# Altium schematic sheet ZHSD-PL-CONNS.SchDoc
size 420 x 297 mm; DrawnBy: UGUR KELES; DocumentNumber: 17; SheetNumber: 17; SheetTotal: 17; Size: A4
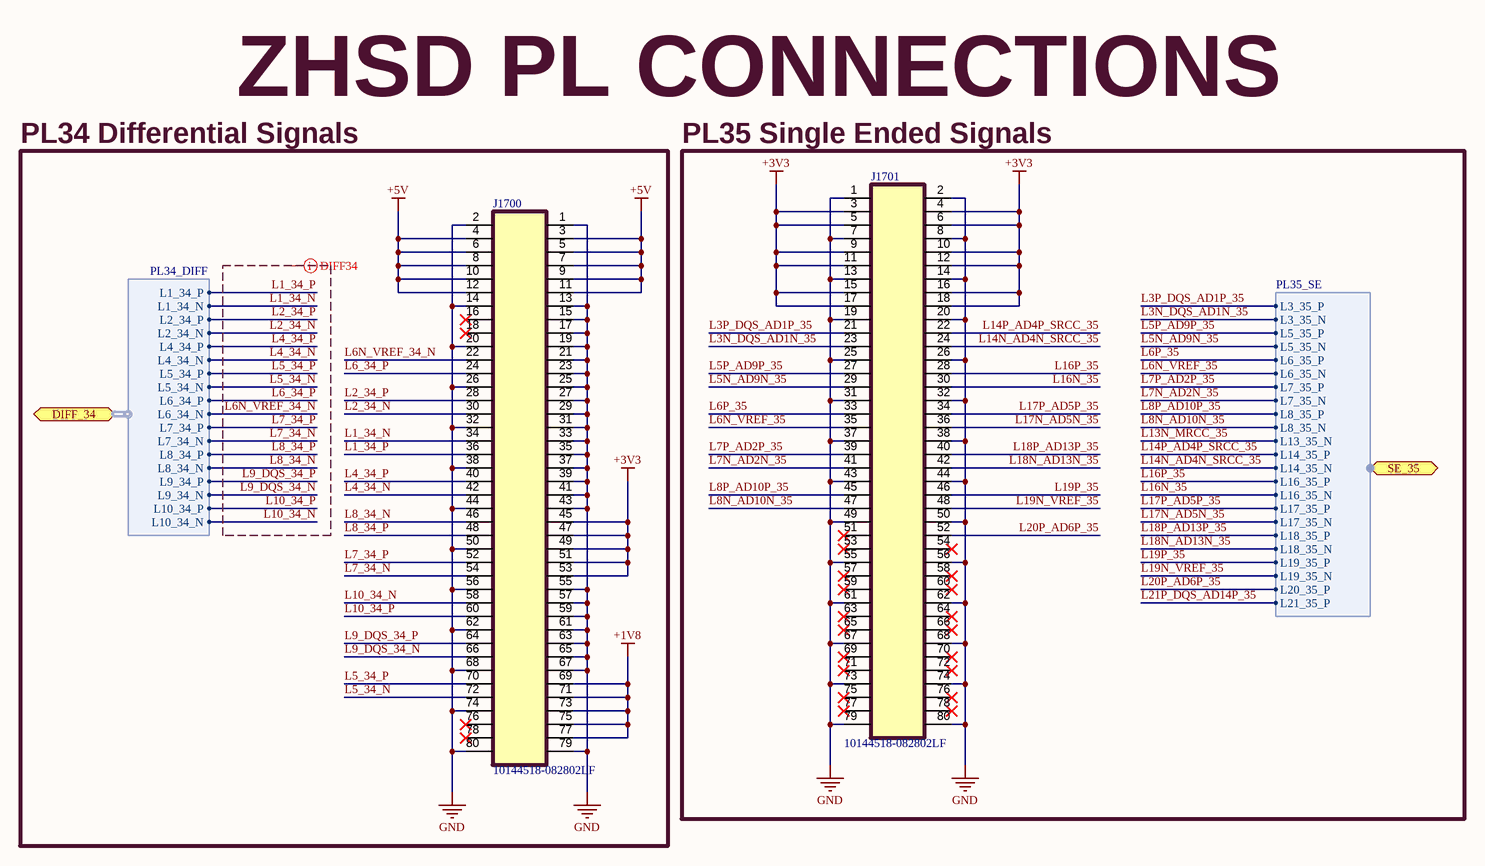
[diagram p0: ZHSD-PL-CONNS.SchDoc]

## Parts
J1700  10144518-082802LF  [10144518-082802LF]
J1701  10144518-082802LF  [10144518-082802LF]

## Blocks framed on the sheet
PL34 Differential Signals: J1700
PL35 Single Ended Signals: J1701

## Ports
DIFF_34 (bidir, harness PL34_DIFF, see ZHSD-Block[276.36,99.18], ZHSD-ZYNQ-PL[229.98,211.12]), SE_35 (bidir, harness PL35_SE, see ZHSD-Block[276.36,91.56], ZHSD-ZYNQ-PL[374.76,81.58])

## Harnesses
PL34_DIFF: L1_34_P, L1_34_N, L2_34_P, L2_34_N, L4_34_P, L4_34_N, L5_34_P, L5_34_N, L6_34_P, L6_34_N, L7_34_P, L7_34_N, L8_34_P, L8_34_N, L9_34_P, L9_34_N, L10_34_P, L10_34_N
PL35_SE: L3_35_P, L3_35_N, L5_35_P, L5_35_N, L6_35_P, L6_35_N, L7_35_P, L7_35_N, L8_35_P, L8_35_N, L13_35_N, L14_35_P, L14_35_N, L16_35_P, L16_35_N, L17_35_P, L17_35_N, L18_35_P, L18_35_N, L19_35_P, L19_35_N, L20_35_P, L21_35_P

## Nets
+1V8: J1700.69 J1700.71 J1700.73 J1700.75 J1700.77
+3V3: J1700.45 J1700.47 J1700.49 J1700.51 J1700.53 J1701.3 J1701.4 J1701.5 J1701.6 J1701.9 J1701.10 J1701.11 J1701.12 J1701.15 J1701.16 J1701.17 J1701.18
+5V: J1700.3 J1700.4 J1700.5 J1700.6 J1700.7 J1700.8 J1700.9 J1700.10 J1700.11 J1700.12
GND: J1700.1 J1700.2 J1700.13 J1700.14 J1700.15 J1700.17 J1700.19 J1700.20 J1700.21 J1700.23 J1700.25 J1700.26 J1700.27 J1700.29 J1700.31 J1700.32 J1700.33 J1700.35 J1700.37 J1700.38 J1700.39 J1700.41 J1700.43 J1700.44 J1700.50 J1700.55 J1700.56 J1700.57 J1700.59 J1700.61 J1700.62 J1700.63 J1700.65 J1700.67 J1700.68 J1700.74 J1700.79 J1700.80 J1701.1 J1701.2 J1701.7 J1701.8 J1701.13 J1701.14 J1701.19 J1701.20 J1701.25 J1701.26 J1701.31 J1701.32 J1701.37 J1701.38 J1701.43 J1701.44 J1701.49 J1701.50 J1701.55 J1701.56 J1701.61 J1701.62 J1701.67 J1701.68 J1701.73 J1701.74 J1701.79 J1701.80
L1_34_N: J1700.34 ; port DIFF_34.L1_34_N
L1_34_P: J1700.36 ; port DIFF_34.L1_34_P
L2_34_N: J1700.30 ; port DIFF_34.L2_34_N
L2_34_P: J1700.28 ; port DIFF_34.L2_34_P
L3N_DQS_AD1N_35: J1701.23 ; port SE_35.L3_35_N
L3P_DQS_AD1P_35: J1701.21 ; port SE_35.L3_35_P
L4_34_N: J1700.42 ; port DIFF_34.L4_34_N
L4_34_P: J1700.40 ; port DIFF_34.L4_34_P
L5_34_N: J1700.72 ; port DIFF_34.L5_34_N
L5_34_P: J1700.70 ; port DIFF_34.L5_34_P
L5N_AD9N_35: J1701.29 ; port SE_35.L5_35_N
L5P_AD9P_35: J1701.27 ; port SE_35.L5_35_P
L6_34_P: J1700.24 ; port DIFF_34.L6_34_P
L6N_VREF_34_N: J1700.22 ; port DIFF_34.L6_34_N
L6N_VREF_35: J1701.35 ; port SE_35.L6_35_N
L6P_35: J1701.33 ; port SE_35.L6_35_P
L7_34_N: J1700.54 ; port DIFF_34.L7_34_N
L7_34_P: J1700.52 ; port DIFF_34.L7_34_P
L7N_AD2N_35: J1701.41 ; port SE_35.L7_35_N
L7P_AD2P_35: J1701.39 ; port SE_35.L7_35_P
L8_34_N: J1700.46 ; port DIFF_34.L8_34_N
L8_34_P: J1700.48 ; port DIFF_34.L8_34_P
L8N_AD10N_35: J1701.47 ; port SE_35.L8_35_N
L8P_AD10P_35: J1701.45 ; port SE_35.L8_35_P
L9_DQS_34_N: J1700.66 ; port DIFF_34.L9_34_N
L9_DQS_34_P: J1700.64 ; port DIFF_34.L9_34_P
L10_34_N: J1700.58 ; port DIFF_34.L10_34_N
L10_34_P: J1700.60 ; port DIFF_34.L10_34_P
L13N_MRCC_35: port SE_35.L13_35_N
L14N_AD4N_SRCC_35: J1701.24 ; port SE_35.L14_35_N
L14P_AD4P_SRCC_35: J1701.22 ; port SE_35.L14_35_P
L16N_35: J1701.30 ; port SE_35.L16_35_N
L16P_35: J1701.28 ; port SE_35.L16_35_P
L17N_AD5N_35: J1701.36 ; port SE_35.L17_35_N
L17P_AD5P_35: J1701.34 ; port SE_35.L17_35_P
L18N_AD13N_35: J1701.42 ; port SE_35.L18_35_N
L18P_AD13P_35: J1701.40 ; port SE_35.L18_35_P
L19N_VREF_35: J1701.48 ; port SE_35.L19_35_N
L19P_35: J1701.46 ; port SE_35.L19_35_P
L20P_AD6P_35: J1701.52 ; port SE_35.L20_35_P
L21P_DQS_AD14P_35: port SE_35.L21_35_P

Not connected (* = marked no-connect by the designer): J1700 16* 18* 76* 78*; J1701 51* 53* 54* 57* 58* 59* 60* 63* 64* 65* 66* 69* 70* 71* 72* 75* 76* 77* 78*

## Layout directives
differential pair; rule Differential Pairs Routing [Pref Gap = 10mil    Min Gap  = 5mil    Max Gap  = 10milPref Width = 3.937mil    Min Width  = 3.543mil    Max Width  = 3.937mil]: L1_34_N, L1_34_P, L2_34_N, L2_34_P, L4_34_N, L4_34_P, L5_34_N, L5_34_P, L6_34_P, L6N_VREF_34_N, L7_34_N, L7_34_P, L8_34_N, L8_34_P, L9_DQS_34_N, L9_DQS_34_P, L10_34_N, L10_34_P

## Notes on the sheet
- ZHSD PL CONNECTIONS
- THIS DOCUMENT AND THE DATA DISCLOSED HEREIN OR
- HEREWITH IS THE PROPERTY OF ALTIUM LIMITED AND MAY
- DWG NO:
- REVISION
- REV:
- DESCRIPTION
- DATE
- APPROVED
- BE FREELY DISTRIBUTED IN WHOLE. NO RIGHTS ARE
- RESERVED OR EXPRESS OR IMPLIED WARANTEE GIVEN.
- ENG:
- APPROVALS
- PROJECT
- DSN:
- CHK:
- REFERENCE DOCUMENTS
- PROJECT REVISION:
- TITLE
- DOCUMENT REVISION:
- DESIGN ITEM:
- BOM:
- FAB DWG:
- PCB DWG:
- ASSY DWG:
- SCALE:
- A3
- SIZE
- CAGE CODE
- FILE NAME
- DWG NO.
- SHEET
- OF
- REV

## Library data of the parts
J1700 J1701 = 10144518-082802LF: BergStak® Lite 0.80mm, Board-to-Board Connector, 80 Positions, Dual Row, Vertical Header; Manufacturer: Amphenol; MPN: 10144518-082802LF